# Altium schematic sheet JTAG_Configuration.SchDoc: Sayma AMC
size 420 x 297 mm; $$Internal___BlkDate: 0:12:25_2-9-18; $$Internal_NAME_PLACEHOLDER: a3sheet; $$Internal_Resolution: 00001mm; $$NotCommonProperty_@NAME: JTAG_Configuration; $$NotCommonProperty_@PRINTORDER: 13; $$NotCommonProperty_@SHEET: 1; $$NotCommonProperty_@SHEETTOTAL: 30; CmpIndex: 158; Drawing Author: G.Kasprowicz; Drawing Number: Sayma AMC; Drawing Project: AMC FMC Carrier Board; Drawing Revision: 2.0; SymIndex: 2141; CheckedBy: P.Kulik,T.Przywozki,W.Ruclo; Author: G.Kasprowicz; CompanyName: WUT ISE; DrawnBy: G.Kasprowicz; Organization: WUT ISE; Address1: PW ISE; Address2: Nowowiejska 15/19 00-665 Warsaw; Address3: gkasprow@gmail.com; DocumentNumber: 10; Revision: 2; SheetNumber: 10; SheetTotal: 32; ModifiedBy: -; CheckedDate: -; Title2: JTAC chain; DivGrp: WUT ISE; Designer: G.Kasprowicz; ModifiedDate: -; ProjectName: Sensor Box
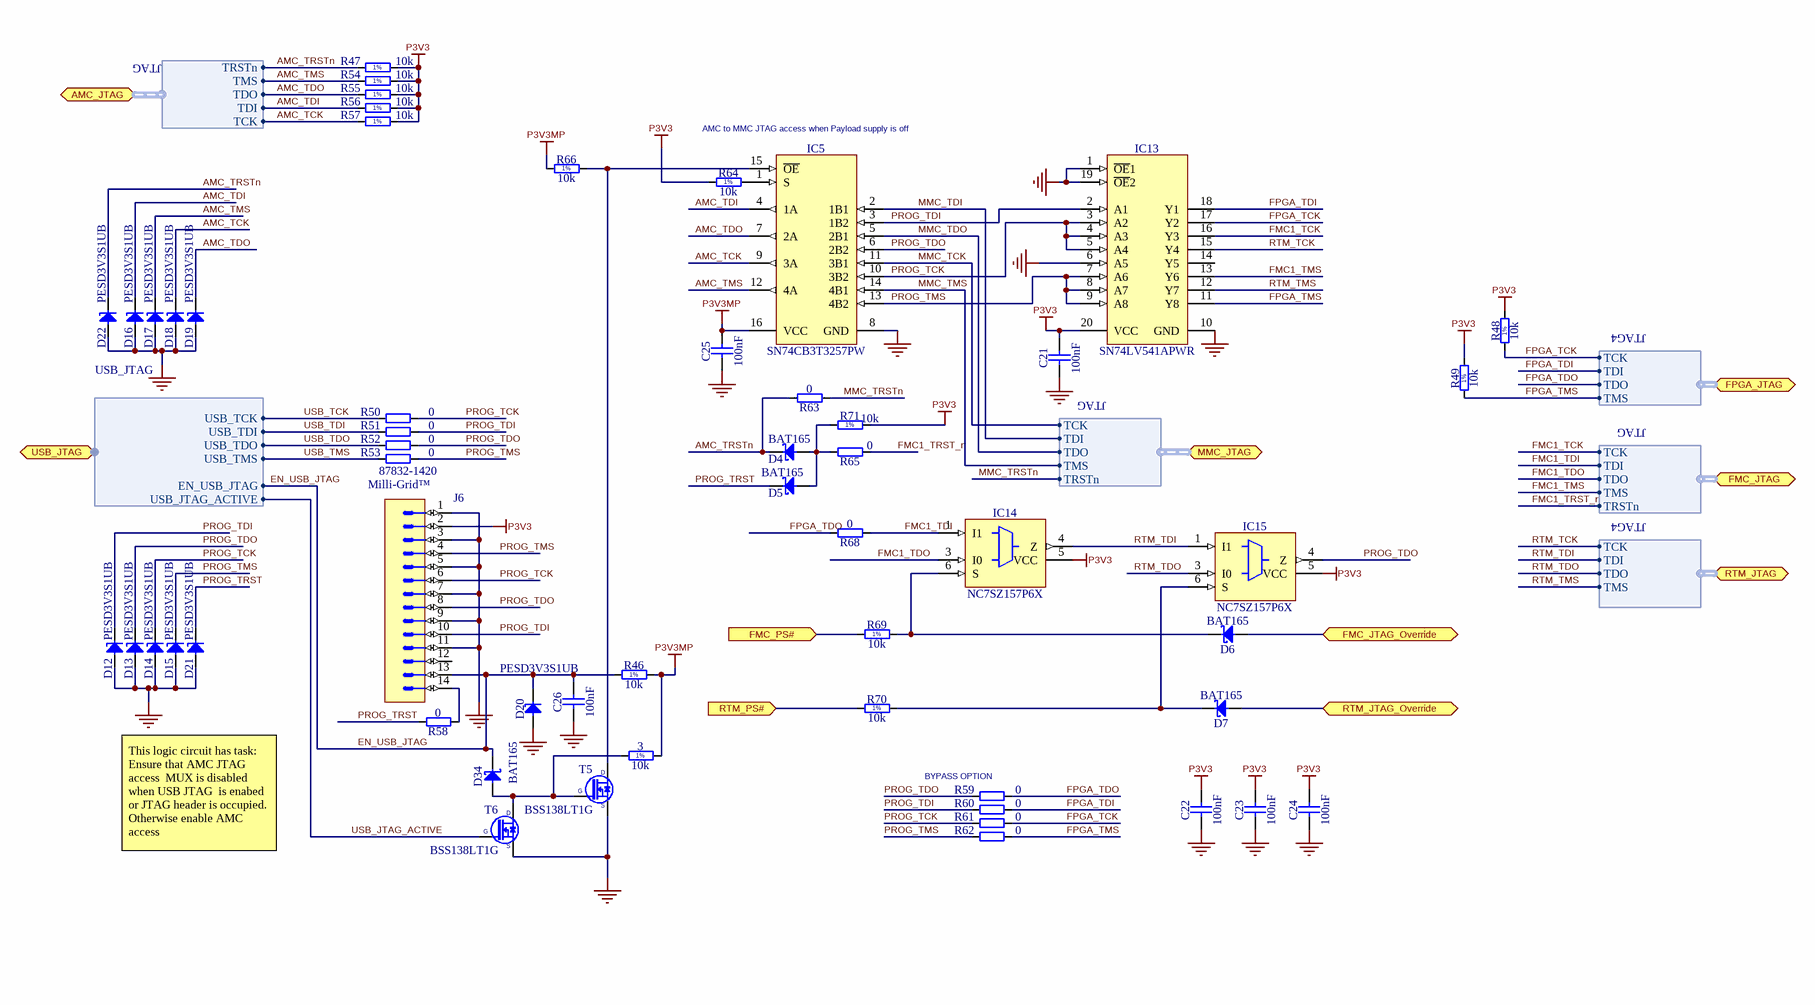
[diagram p0: JTAG_Configuration.SchDoc]

## Parts
3  10k  [RESC1005X40N]
C21  100nF  [CAPC0603X33N]
C22  100nF  [CAPC0603X33N]
C23  100nF  [CAPC0603X33N]
C24  100nF  [CAPC0603X33N]
C25  100nF  [CAPC0603X33N]
C26  100nF  [CAPC0603X33N]
D4  BAT165  [SOD2512X110N]
D5  BAT165  [SOD2512X110N]
D6  BAT165  [SOD2512X110N]
D7  BAT165  [SOD2512X110N]
D12  PESD3V3S1UB  [SODFL1608X65N]
D13  PESD3V3S1UB  [SODFL1608X65N]
D14  PESD3V3S1UB  [SODFL1608X65N]
D15  PESD3V3S1UB  [SODFL1608X65N]
D16  PESD3V3S1UB  [SODFL1608X65N]
D17  PESD3V3S1UB  [SODFL1608X65N]
D18  PESD3V3S1UB  [SODFL1608X65N]
D19  PESD3V3S1UB  [SODFL1608X65N]
D20  PESD3V3S1UB  [SODFL1608X65N]
D21  PESD3V3S1UB  [SODFL1608X65N]
D22  PESD3V3S1UB  [SODFL1608X65N]
D34  BAT165  [SOD2512X110N]
IC5  SN74CB3T3257PW  [SOP65P640X120-16N]
IC13  SN74LV541APWR  [SOP65P640X120-20N]
IC14  NC7SZ157P6X  [SOT65P210X110-6N]
IC15  NC7SZ157P6X  [SOT65P210X110-6N]
J6  Milli-Grid™  Manufacturer Part Number: 87832-1420  [MOLEX_87832-1420]
R46  10k  [RESC1005X40N]
R47  10k  [RESC1005X40N]
R48  10k  [RESC1005X40N]
R49  10k  [RESC1005X40N]
R50  0  [RESC1005X40N]
R51  0  [RESC1005X40N]
R52  0  [RESC1005X40N]
R53  0  [RESC1005X40N]
R54  10k  [RESC1005X40N]
R55  10k  [RESC1005X40N]
R56  10k  [RESC1005X40N]
R57  10k  [RESC1005X40N]
R58  0  [RESC1005X40N]
R59  0  [RESC1005X40N]
R60  0  [RESC1005X40N]
R61  0  [RESC1005X40N]
R62  0  [RESC1005X40N]
R63  0  [RESC1005X40N]
R64  10k  [RESC1005X40N]
R65  0  [RESC1005X40N]
R66  10k  [RESC1005X40N]
R68  0  [RESC1005X40N]
R69  10k  [RESC1005X40N]
R70  10k  [RESC1005X40N]
R71  10k  [RESC1005X40N]
T5  BSS138LT1G  [SOT95P240X110-3N]
T6  BSS138LT1G  [SOT95P240X110-3N]

## Ports
AMC_JTAG (bidir, harness JTAG), FMC_JTAG (bidir, harness JTAG), FMC_JTAG_Override (bidir), FMC_PS# (in), FPGA_JTAG (bidir, harness JTAG4), MMC_JTAG (bidir, harness JTAG), RTM_JTAG (bidir, harness JTAG4), RTM_JTAG_Override (bidir), RTM_PS# (in), USB_JTAG (bidir, harness USB_JTAG)

## Harnesses
JTAG: TCK, TDI, TDO, TMS, TRSTn
JTAG4: TCK, TDI, TDO, TMS
USB_JTAG: USB_TDI, USB_TCK, USB_TMS, USB_TDO, USB_JTAG_ACTIVE, EN_USB_JTAG

## Nets
GND: C21.1 C22.1 C23.1 C24.1 C25.1 C26.1 D12.2(A) D13.2(A) D14.2(A) D15.2(A) D16.2(A) D17.2(A) D18.2(A) D19.2(A) D20.2(A) D21.2(A) D22.2(A) IC5.8(GND) IC13.1(~{OE}1) IC13.6(A5) IC13.10(GND) IC13.19(~{OE}2) IC14.2(GND) IC15.2(GND) J6.1 J6.3 J6.5 J6.7 J6.9 J6.11 T5.2(S) T6.2(S)
P3V3: C21.2 C22.2 C23.2 C24.2 IC13.20(VCC) IC14.5(VCC) IC15.5(VCC) J6.2 R47.1 R48.2 R49.2 R54.1 R55.1 R56.1 R57.1 R64.2 R71.1
P3V3MP: 3.2 C25.2 IC5.16(VCC) R46.2 R66.2
AMC_TCK: D18.1(C) IC5.9(3A) R57.2 ; port AMC_JTAG.TCK
AMC_TDI: D16.1(C) IC5.4(1A) R56.2 ; port AMC_JTAG.TDI
AMC_TDO: D19.1(C) IC5.7(2A) R55.2 ; port AMC_JTAG.TDO
AMC_TMS: D17.1(C) IC5.12(4A) R54.2 ; port AMC_JTAG.TMS
AMC_TRSTn: D4.1(C) D22.1(C) R47.2 R63.2 ; port AMC_JTAG.TRSTn
EN_USB_JTAG: C26.2 D20.1(C) D34.1(C) J6.13 R46.1 ; port USB_JTAG.EN_USB_JTAG
FMC1_TCK: IC13.16(Y3) ; port FMC_JTAG.TCK
FMC1_TDI: IC14.1(I1) R68.1 ; port FMC_JTAG.TDI
FMC1_TDO: IC14.3(I0) ; port FMC_JTAG.TDO
FMC1_TMS: IC13.13(Y6) ; port FMC_JTAG.TMS
FMC1_TRST_n: R65.1 ; port FMC_JTAG.TRSTn
FMC_JTAG_Override: D6.2(A) ; port FMC_JTAG_Override
FMC_PS#: R69.2 ; port FMC_PS#
FPGA_TCK: IC13.17(Y2) R48.1 R61.1 ; port FPGA_JTAG.TCK
FPGA_TDI: IC13.18(Y1) R60.1 ; port FPGA_JTAG.TDI
FPGA_TDO: R59.1 R68.2 ; port FPGA_JTAG.TDO
FPGA_TMS: IC13.11(Y8) R49.1 R62.1 ; port FPGA_JTAG.TMS
MMC_TCK: IC5.11(3B1) ; port MMC_JTAG.TCK
MMC_TDI: IC5.2(1B1) ; port MMC_JTAG.TDI
MMC_TDO: IC5.5(2B1) ; port MMC_JTAG.TDO
MMC_TMS: IC5.14(4B1) ; port MMC_JTAG.TMS
MMC_TRSTn: R63.1 ; port MMC_JTAG.TRSTn
PROG_TCK: D14.1(C) IC5.10(3B2) IC13.3(A2) IC13.4(A3) IC13.5(A4) J6.6 R50.1 R61.2
PROG_TDI: D12.1(C) IC5.3(1B2) IC13.2(A1) J6.10 R51.1 R60.2
PROG_TDO: D13.1(C) IC5.6(2B2) IC15.4(Z) J6.8 R52.1 R59.2
PROG_TMS: D15.1(C) IC5.13(4B2) IC13.7(A6) IC13.8(A7) IC13.9(A8) J6.4 R53.1 R62.2
PROG_TRST: D5.1(C) D21.1(C) R58.2
RTM_JTAG_Override: D7.2(A) ; port RTM_JTAG_Override
RTM_PS#: R70.2 ; port RTM_PS#
RTM_TCK: IC13.15(Y4) ; port RTM_JTAG.TCK
RTM_TDI: IC14.4(Z) IC15.1(I1) ; port RTM_JTAG.TDI
RTM_TDO: IC15.3(I0) ; port RTM_JTAG.TDO
RTM_TMS: IC13.12(Y7) ; port RTM_JTAG.TMS
USB_JTAG_ACTIVE: T6.1(G) ; port USB_JTAG.USB_JTAG_ACTIVE
USB_TCK: R50.2 ; port USB_JTAG.USB_TCK
USB_TDI: R51.2 ; port USB_JTAG.USB_TDI
USB_TDO: R52.2 ; port USB_JTAG.USB_TDO
USB_TMS: R53.2 ; port USB_JTAG.USB_TMS
Net3_1: 3.1 D34.2(A) T5.1(G) T6.3(D)
NetD4_2: D4.2(A) D5.2(A) R65.2 R71.2
NetD6_1: D6.1(C) IC14.6(S) R69.1
NetD7_1: D7.1(C) IC15.6(S) R70.1
NetIC5_1: IC5.1(S) R64.1
NetIC5_15: IC5.15(~{OE}) R66.1 T5.3(D)
NetJ6_14: J6.14 R58.1

Not connected (* = marked no-connect by the designer): IC13 14(Y5); J6 12

## Notes on the sheet
- AMC to MMC JTAG access when Payload supply is off
- (near R59) BYPASS OPTION
- This logic circuit has task: Ensure that AMC JTAG access  MUX is disabled when USB JTAG  is enabed or JTAG header is occupied. Otherwise enable AMC access
- Project/Equipment
- Document
- Designer
- Drawn by
- Check.by
- Copyright WUT ISE 2018.
  This documentation describes Open Hardware and is licensed under the CERN OHL v.1.1. You may redistribute and modify this documentation under the terms of the CERN OHL v.1.1. (http://ohwr.org/CERNOHL). This documentation is distributed WITHOUT ANY EXPRESS OR IMPLIED WARRANTY, INCLUDING OF MERCHANTABILITY, SATISFACTORY QUALITY AND FITNESS FOR A PARTICULAR PURPOSE. Please see the CERN OHL v.1.1 for applicable conditions.
- Contact
- File
- Last Mod.
- Print Date
- Sheet
- Size
- A3
- of
- Rev
- (in symbol R0402_10K_1%_0.0625W_100PPM) 1%

## Library data of the parts
3 R46-R49 R54-R57 R64 R66 R69-R71 = R0402_10K_1%_0.0625W_100PPM: Resistor - 1%; Manufacturer: GENERIC; Part Description: General Purpose Thick Film Chip Resistor; Manufacturer1 Part Number: 232270671003L; TC: ±100ppm/°C; PressFit: No; Manufacturer Part Number: R0402_10K_1%_0.0625W_100PPM; Part Number: R0402_10K_1%_0.0625W_100PPM; Tolerance: ±1%; Value: 10k; Component Kind: Standard; Component Type: Standard; Pin Count: 2; Status: Not Recommended; Power: 0.0625W; Case: 0402; Mounted: Yes; Sense: No; Socket: No; SMD: Yes; Manufacturer1 Example: YAGEO PHYCOMP; Manufacturer1 ComponentHeight: 0.4mm; HelpURL: \\cern.ch\dfs\Applications\Altium\Datasheets\R0402_Phycomp_RC0402.pdf; Author: CERN DEM JLC; CreateDate: 03.12.2007; LatestRevisionDate: 17.10.2012
C21-C26 = CC0201_100NF_6.3V_10%_X5R: Non-polarised capacitor; Manufacturer: GENERIC; Part Description: SMD Multilayer Chip Ceramic Capacitor; Manufacturer1 Part Number: 02016D104KAT2A; Tolerance: ±10%; Voltage: 6.3V; TC: X5R; Manufacturer Part Number: CC0201_100NF_6.3V_10%_X5R; Part Number: CC0201_100NF_6.3V_10%_X5R; Value: 100nF; Component Kind: Standard; Component Type: Standard; Pin Count: 2; Status: Not Recommended; Case: 0201; Mounted: Yes; Socket: No; SMD: Yes; Sense: No; Manufacturer1 Example: AVX; Manufacturer1 ComponentHeight: 0.33mm; HelpURL: \\cern.ch\dfs\Applications\Altium\Datasheets\CC0201_X5R_AVX.pdf; Author: CERN DEM JLC; CreateDate: 03.12.2007; LatestRevisionDate: 03.12.2007
D4-D7 D34 = BAT165: Schottky Diode; Manufacturer: INFINEON; Part Description: Medium Power AF Schottky Diode; Voltage: 40V; Power: 750mA; PressFit: No; Bonding: No; Manufacturer Part Number: BAT165; PackageDescription: Small Outline Diode (SOD-323), 1.70mm W X 1.25mm L X 1.10mm H body,  IPC Medium Density; Part Number: BAT165; Component Kind: Standard; Component Type: Standard; Device: BAT165; Pin Count: 2; Case: SOD323; Mounted: Yes; Socket: No; SMD: Yes; Sense: No; ComponentHeight: 1.1mm; HelpURL: \\cern.ch\dfs\Applications\Altium\Datasheets\BAT165.pdf; Author: CERN DEM JLC; CreateDate: 12.11.2014; LatestRevisionDate: 12.11.2014
D12-D22 = PESD3V3S1UB: ESD protection diode; Manufacturer: NXP SEMICONDUCTORS; Part Description: ESD protection diode (23kV); Voltage: 3V3; Power: 330W; PressFit: No; Bonding: No; Manufacturer Part Number: PESD3V3S1UB; PackageDescription: Ultra Small Outline Diode Flat Lead (SOD-523), Body; 1.2mm L X 0.8mm W X 0.65mm H, IPC Medium Density; Part Number: PESD3V3S1UB; Component Kind: Standard; Component Type: Standard; Device: PESD3V3S1UB; Pin Count: 2; Case: SOD523; Mounted: Yes; Socket: No; SMD: Yes; Sense: No; ComponentHeight: 0.65mm; HelpURL: \\cern.ch\dfs\Applications\Altium\Datasheets\PESD3V3S1UB.pdf; Author: CERN DEM JLC; CreateDate: 29.11.2012; LatestRevisionDate: 29.11.2012
IC5 = SN74CB3T3257PW: 4-BIT 1-OF-2 FET Multiplexer/Demultiplexer 2.5V/3.3V Low-Voltage Bus Switch 5V Tolerant Shifter; Manufacturer: TEXAS INSTRUMENTS; PressFit: No; Bonding: No; Manufacturer Part Number: SN74CB3T3257PW; PackageDescription: SOP, 0.65mm pitch; 16 pin, 4.40mm W X 5.00mm L X 1.20mm H body IPC Medium Density; Part Description: 4-Bit 1-of-2 FET Multiplexer/Demultiplexer 2.5V/3.3V Low-Voltage Bus Switch 5V Tolerant Shifter; Part Number: SN74CB3T3257PW; Component Kind: Standard; Component Type: Standard; Device: SN74CB3T3257PW; Pin Count: 16; Case: TSSOP16; Mounted: Yes; Socket: No; SMD: Yes; Sense: No; ComponentHeight: 1.2mm; Author: CERN DEM JLC; HelpURL: \\cern.ch\dfs\Applications\Altium\Datasheets\SN74CB3T3257PW.pdf; CreateDate: 30.01.2012; LatestRevisionDate: 30.01.2012
IC13 = SN74LV541APWR: Octal Buffer/Line Driver with 3-State Outputs; Manufacturer: TEXAS INSTRUMENTS; Part Description: Octal Bus Transceiver/Driver with 3-State Outputs; PressFit: No; Bonding: No; Manufacturer Part Number: SN74LV541APWR; PackageDescription: SOP, 20-Leads, Body 6.5x4.4mm, Pitch 0.65mm, IPC Medium Density; Part Number: SN74LV541APWR; Component Kind: Standard; Component Type: Standard; Device: SN74LV541APWR; Pin Count: 20; Case: TSSOP20; Mounted: Yes; Socket: No; SMD: Yes; Sense: No; ComponentHeight: 1.2mm; Author: CERN DEM JLC; HelpURL: \\cern.ch\dfs\Applications\Altium\Datasheets\SN74LV541APWR.pdf; CreateDate: 07.07.2014; LatestRevisionDate: 07.07.2014
IC14 IC15 = NC7SZ157P6X: TinyLogic® UHS 2-Input Non-Inverting Multiplexer; Manufacturer: FAIRCHILD SEMICONDUCTOR; PressFit: No; Bonding: No; Manufacturer Part Number: NC7SZ157P6X; PackageDescription: SOT363, 0.65mm pitch; 6 pin, 1.40mm W X 2.15mm L, IPC Medium Density; Part Description: TinyLogic® UHS 2-Input Non-Inverting Multiplexer; Part Number: NC7SZ157P6X; Component Kind: Standard; Component Type: Standard; Device: NC7SZ157P6X; Pin Count: 6; Case: SOT363; Mounted: Yes; Socket: No; SMD: Yes; Sense: No; ComponentHeight: 1.1mm; Author: CERN DEM JLC; HelpURL: \\cern.ch\dfs\Applications\Altium\Datasheets\NC7SZ157P6X.pdf; CreateDate: 22.03.2012; LatestRevisionDate: 22.03.2012
J6 = MOLEX_87832-1420: Connector 14 Male; Manufacturer: MOLEX; Part Description: 2.00mm (.079") Pitch Milli-Grid™ Header, Surface Mount, Vertical, Shrouded, 14 Circuits,with Locking Windows and Centre Polarization Slot, PCB Locator; PressFit: No; Part Number: MOLEX_87832-1420; Component Kind: Standard; Component Type: Standard; Pin Count: 14; Family: Milli-Grid™; Mounted: Yes; Socket: No; SMD: Yes; Sense: No; Status: None; ComponentHeight: 7.6mm; HelpURL: \\cern.ch\dfs\Applications\Altium\Datasheets\MOLEX_87832-1420.pdf; Author: CERN DEM JLC; CreateDate: 09.09.2008; LatestRevisionDate: 09.09.2008
R50-R53 R58-R63 R65 R68 = R0402_0R_JUMPER: Resistor; Manufacturer: GENERIC; Part Description: 1A (0.05R Max DC Resistance) Zero Ohm Jumper; Manufacturer1 Part Number: 232270591001L; PressFit: No; Manufacturer Part Number: R0402_0R_JUMPER; Part Number: R0402_0R_JUMPER; Value: 0; Component Kind: Standard; Component Type: Standard; Pin Count: 2; Status: Not Recommended; Case: 0402; Mounted: Yes; Sense: No; Socket: No; SMD: Yes; Manufacturer1 Example: YAGEO PHYCOMP; Manufacturer1 ComponentHeight: 0.4mm; HelpURL: \\cern.ch\dfs\Applications\Altium\Datasheets\R0402_Phycomp_RC0402.pdf; Author: CERN DEM JLC; CreateDate: 03.12.2007; LatestRevisionDate: 17.10.2012
T5 T6 = BSS138LT1G: N-CHANNEL MOSFET WITH DIODE; Manufacturer: ON SEMICONDUCTOR; Part Description: 50V 200mA N-Channel Enhancement Mode Field-Effect Transistor; PressFit: No; Bonding: No; Manufacturer Part Number: BSS138LT1G; PackageDescription: SOT23 3-Leads, Pitch 0.95mm - Body 1.4x3mm, IPC Medium Density; Part Number: BSS138LT1G; Component Kind: Standard; Component Type: Standard; Device: BSS138LT1G; Pin Count: 3; Case: SOT23-3; Mounted: Yes; Socket: No; SMD: Yes; Sense: No; ComponentHeight: 1.11mm; HelpURL: \\cern.ch\dfs\Applications\Altium\Datasheets\BSS138LT1G.pdf; Author: CERN DEM JLC; CreateDate: 23.03.2009; LatestRevisionDate: 23.03.2009